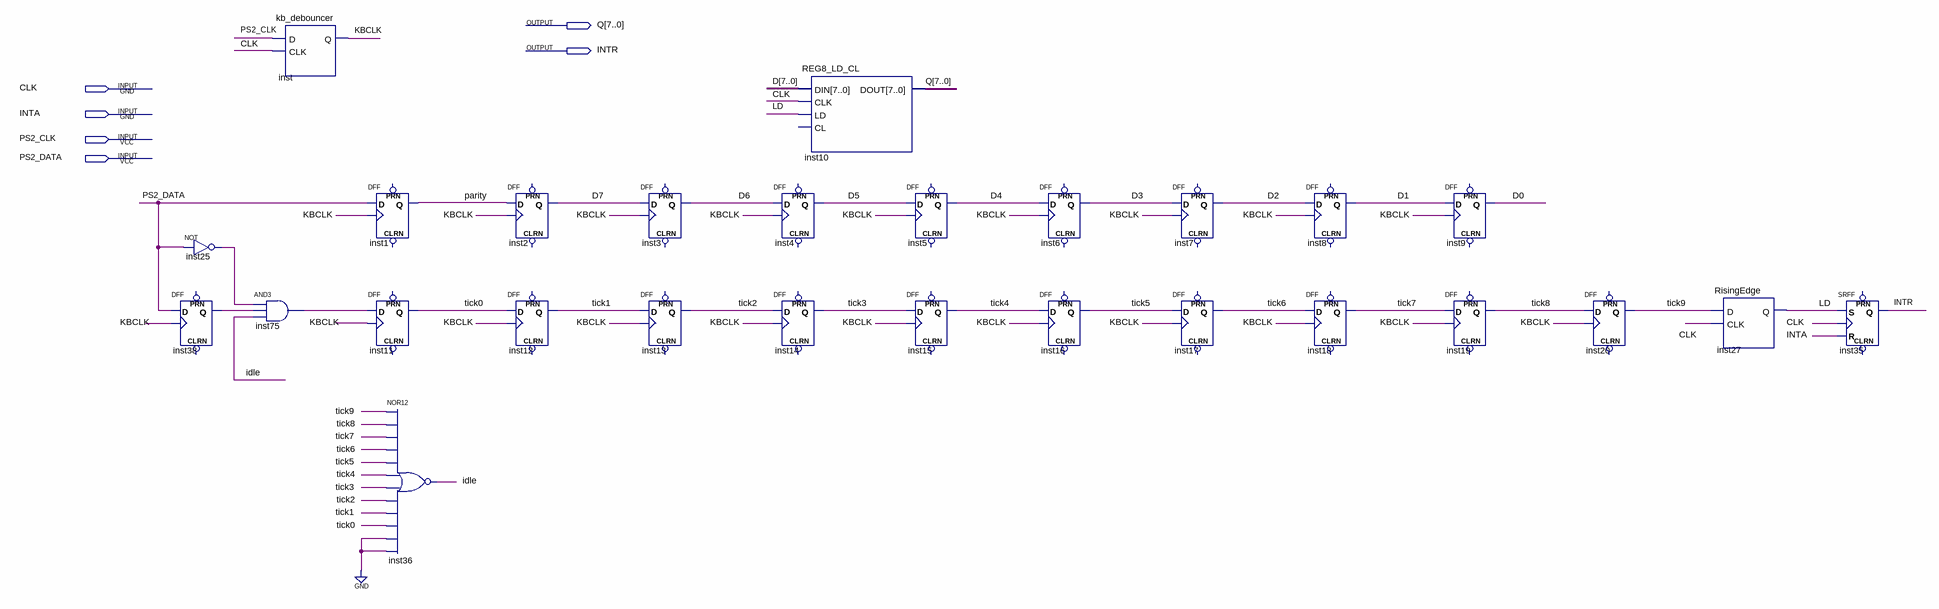
[diagram p0: schematic sheet]
// Quartus schematic kb_controller.bdf as structural Verilog: 27 symbols, 6 pins
module kb_controller (
  input  CLK,
  input  INTA,
  input  PS2_CLK,
  input  PS2_DATA,
  output [7:0] Q,
  output INTR
);

  wire idle, inst25_out, inst38_q, inst75_out, KBCLK, LD, parity, tick0, tick1, tick2, tick3, tick4, tick5,
       tick6, tick7, tick8, tick9;
  wire [7:0] D;

  not inst25 (inst25_out, PS2_DATA);
  DFF inst38 (.CLK(KBCLK), .D(PS2_DATA), .Q(inst38_q));  // open: CLRN, PRN
  kb_debouncer inst (.D(PS2_CLK), .CLK(CLK), .Q(KBCLK));
  and inst75 (inst75_out, inst25_out, inst38_q, idle);
  DFF inst1 (.CLK(KBCLK), .D(PS2_DATA), .Q(parity));  // open: CLRN, PRN
  DFF inst11 (.CLK(KBCLK), .D(inst75_out), .Q(tick0));  // open: CLRN, PRN
  nor inst36 (idle, tick9, tick8, tick7, tick6, tick5, tick4, tick3, tick2, tick1, tick0, 1'b0, 1'b0);
  DFF inst2 (.CLK(KBCLK), .D(parity), .Q(D[7]));  // open: CLRN, PRN
  DFF inst12 (.CLK(KBCLK), .D(tick0), .Q(tick1));  // open: CLRN, PRN
  DFF inst3 (.CLK(KBCLK), .D(D[7]), .Q(D[6]));  // open: CLRN, PRN
  DFF inst13 (.CLK(KBCLK), .D(tick1), .Q(tick2));  // open: CLRN, PRN
  REG8_LD_CL inst10 (.DIN(D), .CLK(CLK), .LD(LD), .DOUT(Q));  // open: CL
  DFF inst4 (.CLK(KBCLK), .D(D[6]), .Q(D[5]));  // open: CLRN, PRN
  DFF inst14 (.CLK(KBCLK), .D(tick2), .Q(tick3));  // open: CLRN, PRN
  DFF inst5 (.CLK(KBCLK), .D(D[5]), .Q(D[4]));  // open: CLRN, PRN
  DFF inst15 (.CLK(KBCLK), .D(tick3), .Q(tick4));  // open: CLRN, PRN
  DFF inst6 (.CLK(KBCLK), .D(D[4]), .Q(D[3]));  // open: CLRN, PRN
  DFF inst16 (.CLK(KBCLK), .D(tick4), .Q(tick5));  // open: CLRN, PRN
  DFF inst7 (.CLK(KBCLK), .D(D[3]), .Q(D[2]));  // open: CLRN, PRN
  DFF inst17 (.CLK(KBCLK), .D(tick5), .Q(tick6));  // open: CLRN, PRN
  DFF inst8 (.CLK(KBCLK), .D(D[2]), .Q(D[1]));  // open: CLRN, PRN
  DFF inst18 (.CLK(KBCLK), .D(tick6), .Q(tick7));  // open: CLRN, PRN
  DFF inst9 (.CLK(KBCLK), .D(D[1]), .Q(D[0]));  // open: CLRN, PRN
  DFF inst19 (.CLK(KBCLK), .D(tick7), .Q(tick8));  // open: CLRN, PRN
  DFF inst20 (.CLK(KBCLK), .D(tick8), .Q(tick9));  // open: CLRN, PRN
  RisingEdge inst27 (.D(tick9), .CLK(CLK), .Q(LD));
  SRFF inst35 (.S(LD), .R(INTA), .CLK(CLK), .Q(INTR));  // open: PRN, CLRN
endmodule
